# Altium project UWBNode.PrjPCB
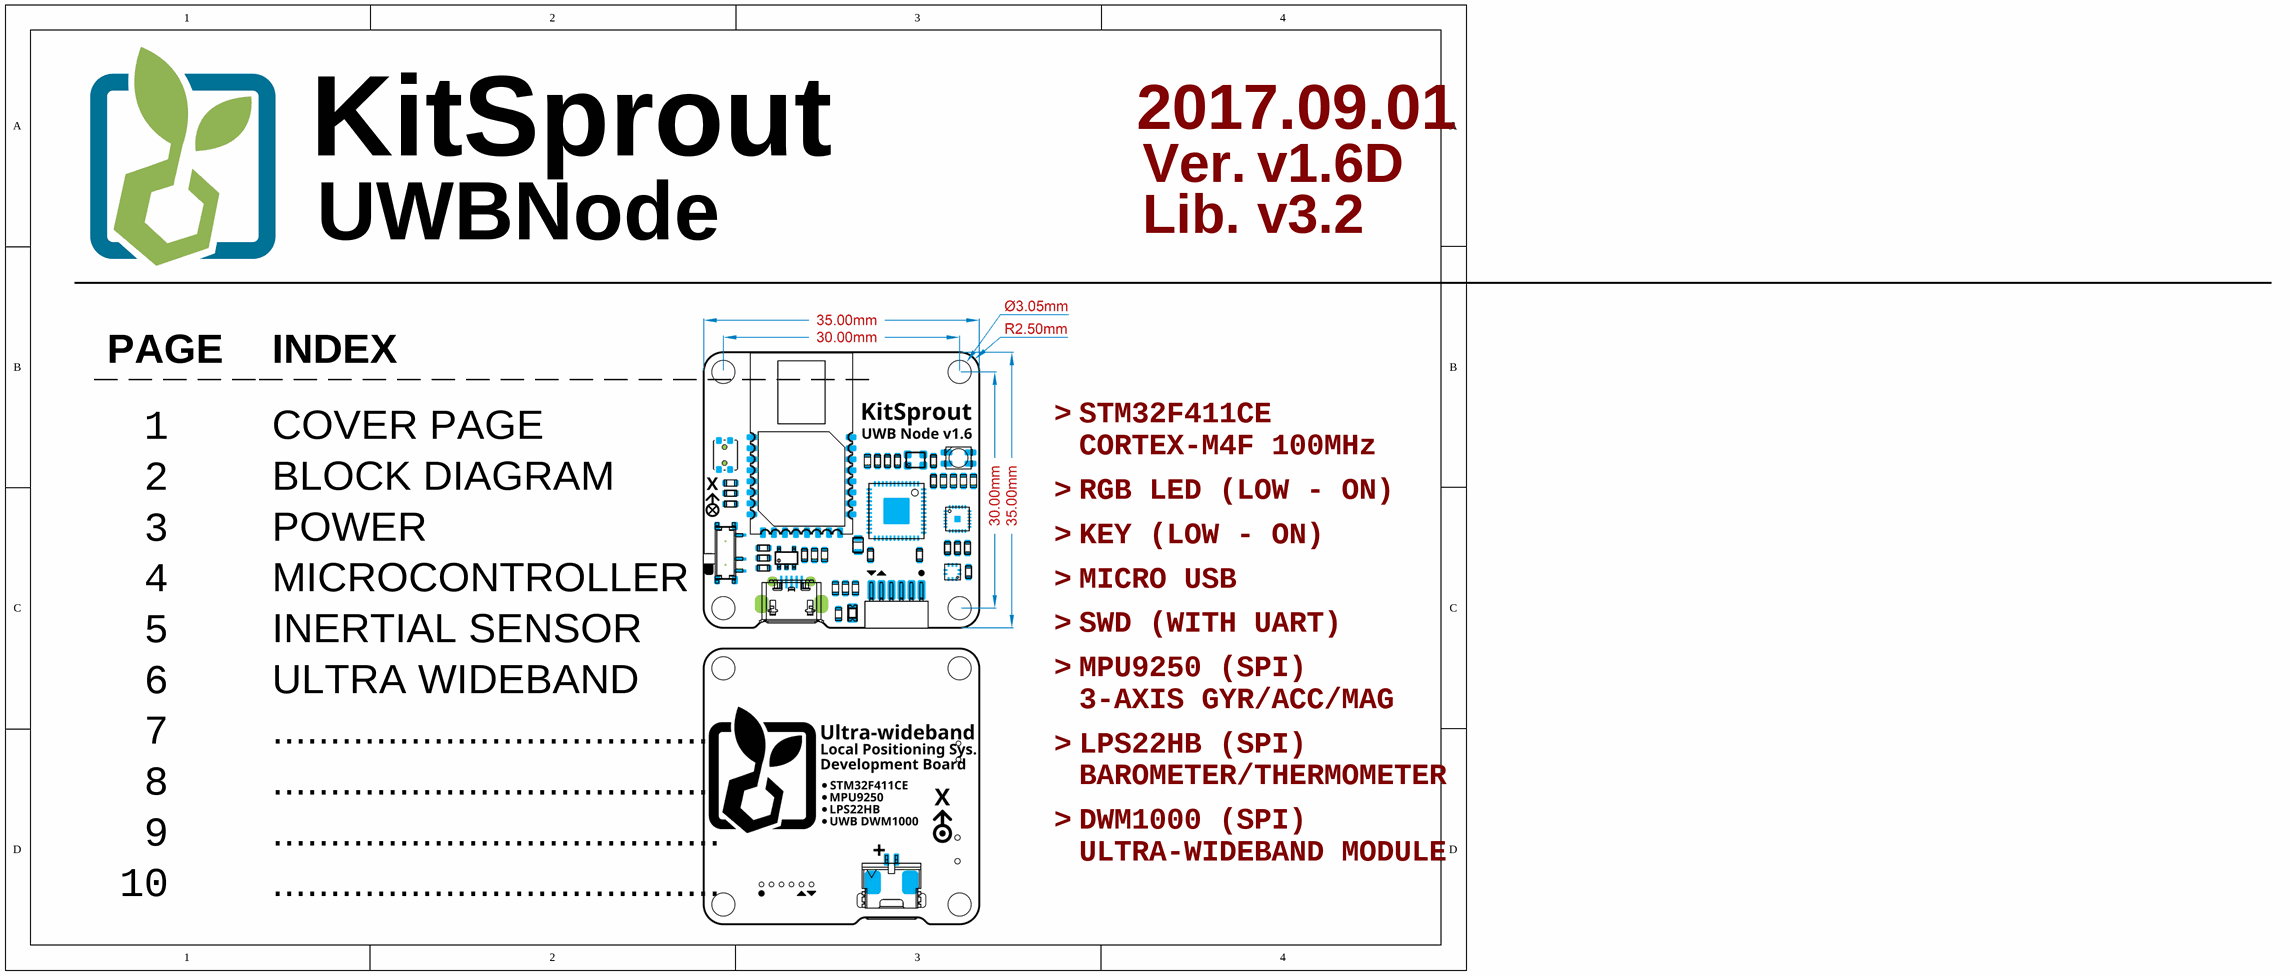
[diagram p0: [01] COVER PAGE.SchDoc]
6 sheets, 43 parts. Net scope: flat (ports and power ports of the same name join across sheets).
Board file: UWBNode.PcbDoc
Sheets:
  [01] COVER PAGE.SchDoc
  [02] BLOCK DIAGRAM.SchDoc
    LDO = [03] POWER.SchDoc
    INERTIAL SENSOR = [05] INERTIAL SENSOR.SchDoc
    STM32 = [04] MICROCONTROLLER.SchDoc
    DWM1000 = [06] ULTRA WIDEBAND.SchDoc

## Sheet [01] COVER PAGE.SchDoc: UWBNode
size A4; Author: Hom; CompanyName: KitSprout; DrawnBy: Hom; Engineer: Hom; Organization: KitSprout; Revision: B; SheetNumber: 1; SheetTotal: 6; Version: v1.6D; LibVersion: v3.2

### Notes on the sheet
- 2017.09.01
- Ver.
- ________________________________________________________________________
- Lib.
- _ _ _ _ _
- PAGE
- _ _ _ _ _ _ _ _ _ _ _ _ _ _ _ _ _ _
- INDEX
- 1
- COVER PAGE
- >
- STM32F411CE
- CORTEX-M4F 100MHz
- 2
- 3
- BLOCK DIAGRAM
- POWER
- RGB LED (LOW - ON)
- KEY (LOW - ON)
- 4
- MICROCONTROLLER
- MICRO USB
- 5
- INERTIAL SENSOR
- SWD (WITH UART)
- 6
- ULTRA WIDEBAND
- MPU9250 (SPI)
- 3-AXIS GYR/ACC/MAG
- 7
- 8
- .......................................
- LPS22HB (SPI)
- BAROMETER/THERMOMETER
- 9
- DWM1000 (SPI)
- ULTRA-WIDEBAND MODULE
- 10

## Sheet [02] BLOCK DIAGRAM.SchDoc: Template
size A4; Author: Hom; CompanyName: KitSprout; DrawnBy: Hom; Engineer: Hom; Organization: KitSprout; Revision: A; SheetNumber: 2; SheetTotal: 6; Version: 0.0; LibVersion: 0.0
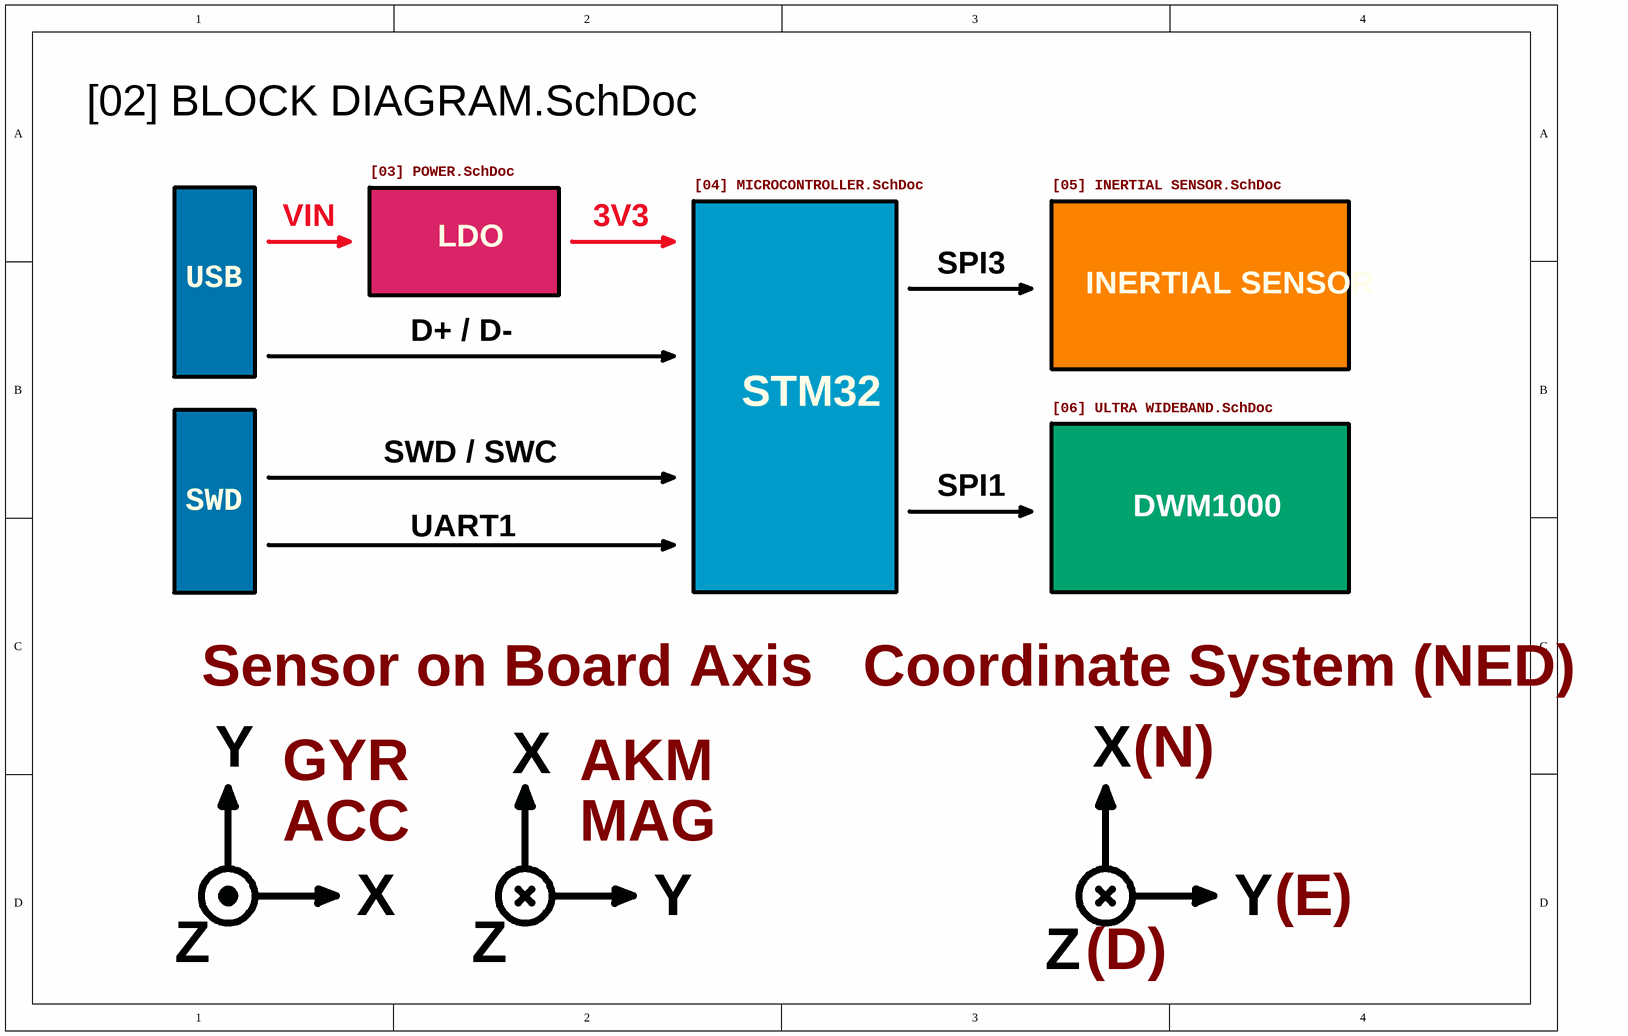
[diagram p1: [02] BLOCK DIAGRAM.SchDoc]

### Sub-sheets
DWM1000 = [06] ULTRA WIDEBAND.SchDoc: no entries
INERTIAL SENSOR = [05] INERTIAL SENSOR.SchDoc: no entries
LDO = [03] POWER.SchDoc: no entries
STM32 = [04] MICROCONTROLLER.SchDoc: no entries

### Notes on the sheet
- VIN
- 3V3
- SPI3
- USB
- D+ / D-
- SWD / SWC
- SPI1
- UART1
- SWD
- Sensor on Board Axis
- Coordinate System (NED)
- Y
- GYR
- X
- AKM
- (N)
- ACC
- MAG
- (E)
- Z
- (D)

## Sheet [03] POWER.SchDoc: Template
size A4; Author: Hom; CompanyName: KitSprout; DrawnBy: Hom; Engineer: Hom; Organization: KitSprout; Revision: A; SheetNumber: 3; SheetTotal: 6; Version: 0.0; LibVersion: 0.0
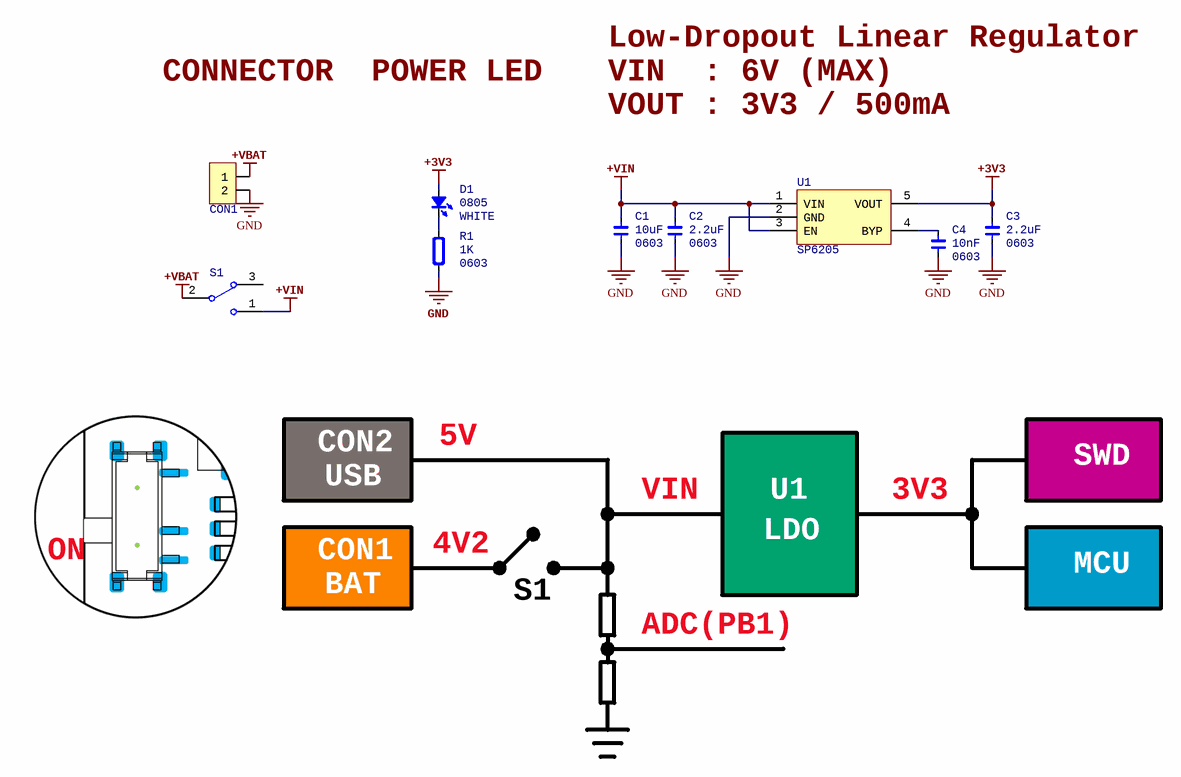
[diagram p2: [03] POWER.SchDoc]

### Parts
C1  Type: 0603  [CAP_0603]  (hidden comment: 10uF)
C2  Type: 0603  [CAP_0603]  (hidden comment: 2.2uF)
C3  Type: 0603  [CAP_0603]  (hidden comment: 2.2uF)
C4  Type: 0603  [CAP_0603]  (hidden comment: 10nF)
CON1  MX1.25_2P  [MX1.25_S90_2P]  (value not drawn)
D1  Type: 0805  [LED_0805_YELLOW]  (hidden comment: WHITE)
R1  Type: 0603  [RES_0603]  (hidden comment: 1K)
S1  SPDT 3P  [SwitchSPDT_2.8X6.6_90]  (value not drawn)
U1  SP6205  [SOT23-5]

### Nets
+3V3: C3.2 D1.1(A) U1.5(VOUT)
+VBAT: CON1.1 S1.2
+VIN: C1.2 C2.2 S1.1 U1.1(VIN) U1.3(EN)
GND: C1.1 C2.1 C3.1 C4.1 CON1.2 R1.1 U1.2(GND)
NetC4_2: C4.2 U1.4(BYP)
NetD1_2: D1.2(K) R1.2

Not connected (* = marked no-connect by the designer): S1 3

### Notes on the sheet
- CONNECTOR
- POWER LED
- Low-Dropout Linear Regulator
- VIN  : 6V (MAX)
- VOUT : 3V3 / 500mA
- CON2
- USB
- 5V
- SWD
- VIN
- LDO
- U1
- 3V3
- ON
- CON1
- BAT
- 4V2
- S1
- MCU
- ADC(PB1)

### Library data of the parts
C1-C4 = Cap_0603: Capacitor
  C1: Value: 10uF
  C2 C3: Value: 2.2uF
  C4: Value: 10nF
CON1 = MX1.25_2P: MX
D1 = LED_0805: LED; Value: WHITE
R1 = Res_0603: Resistor; Value: 1K
S1 = SwitchSPDT_2.8x6.6_90: Switch; Value: SPDT 3P; Type: SPDT
U1 = SP6205: Power; Type: SOT23-5

## Sheet [05] INERTIAL SENSOR.SchDoc: Template
size A4; Author: Hom; CompanyName: KitSprout; DrawnBy: Hom; Engineer: Hom; Organization: KitSprout; Revision: A; SheetNumber: 5; SheetTotal: 6; Version: 0.0; LibVersion: 0.0
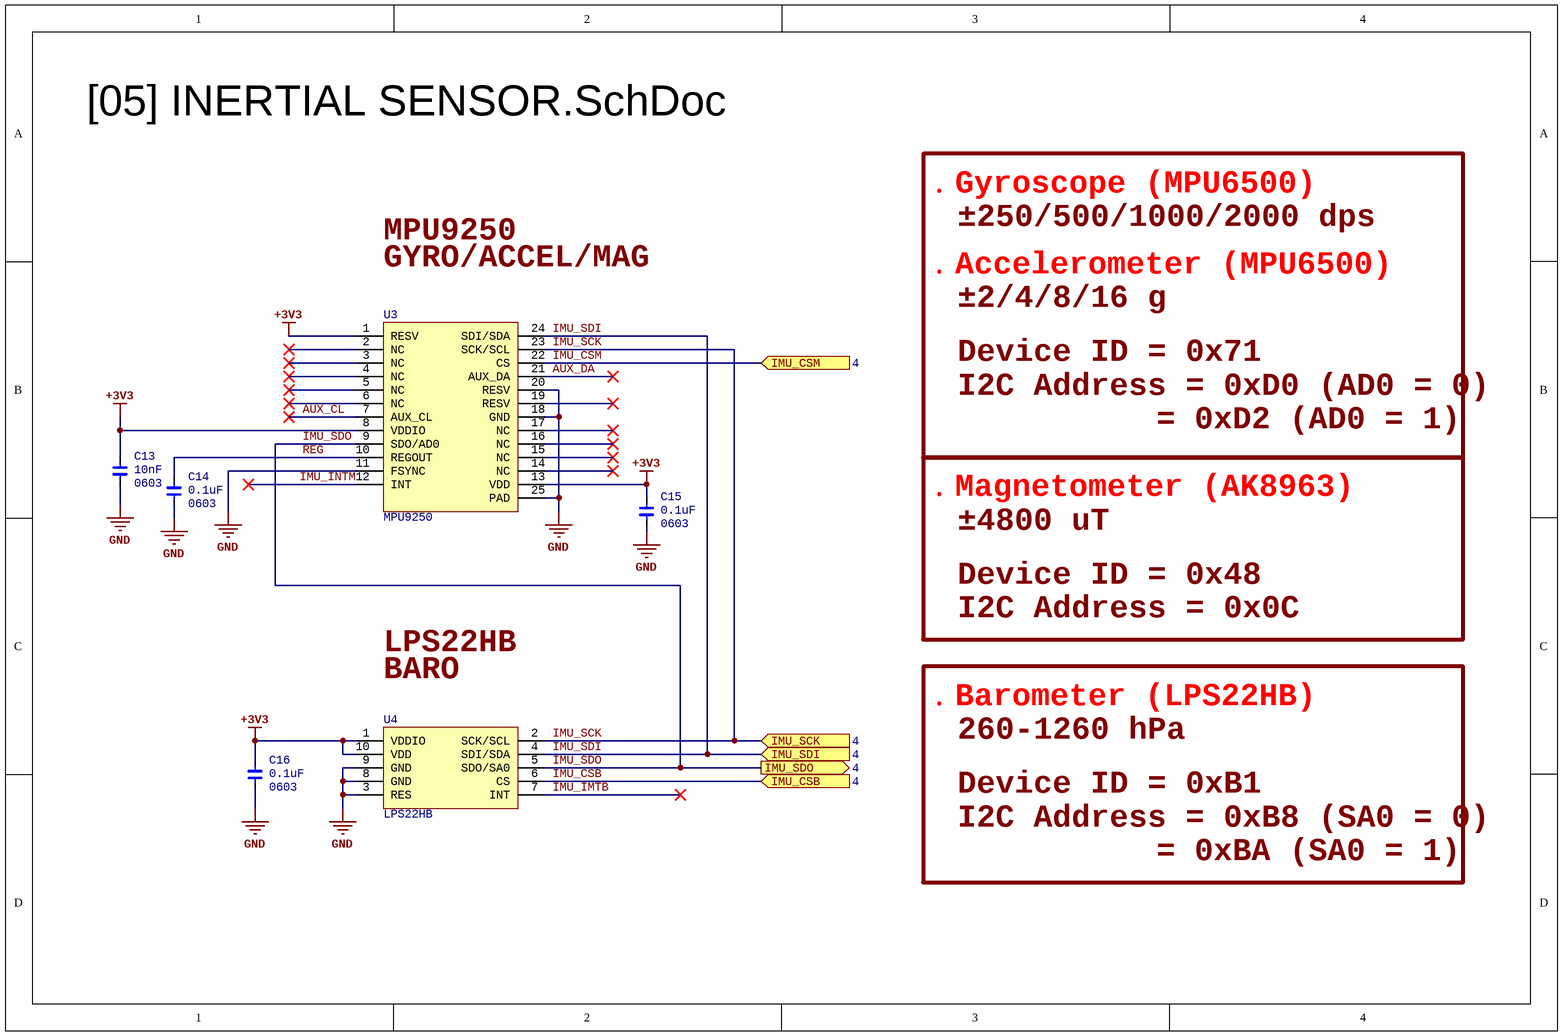
[diagram p3: [05] INERTIAL SENSOR.SchDoc]

### Parts
C13  Type: 0603  [CAP_0603]  (hidden comment: 10nF)
C14  Type: 0603  [CAP_0603]  (hidden comment: 0.1uF)
C15  Type: 0603  [CAP_0603]  (hidden comment: 0.1uF)
C16  Type: 0603  [CAP_0603]  (hidden comment: 0.1uF)
U3  MPU9250  [QFN_P0.4_24]
U4  LPS22HB  [HCLGA-2x2_10]

### Ports
IMU_CSB (in, see 4), IMU_CSM (in, see 4), IMU_SCK (in, see 4), IMU_SDI (in, see 4), IMU_SDO (out, see 4)

### Nets
+3V3: C13.2 C15.2 C16.2 U3.1(RESV) U3.8(VDDIO) U3.13(VDD) U4.1(VDDIO) U4.10(VDD)
GND: C13.1 C14.1 C15.1 C16.1 U3.11(FSYNC) U3.18(GND) U3.20(RESV) U3.25(PAD) U4.3(RES) U4.8(GND) U4.9(GND)
AUX_CL: U3.7(AUX_CL)
AUX_DA: U3.21(AUX_DA)
IMU_CSB: U4.6(CS) ; port IMU_CSB
IMU_CSM: U3.22(CS) ; port IMU_CSM
IMU_IMTB: U4.7(INT)
IMU_INTM: U3.12(INT)
IMU_SCK: U3.23(SCK/SCL) U4.2(SCK/SCL) ; port IMU_SCK
IMU_SDI: U3.24(SDI/SDA) U4.4(SDI/SDA) ; port IMU_SDI
IMU_SDO: U3.9(SDO/AD0) U4.5(SDO/SA0) ; port IMU_SDO
REG: C14.2 U3.10(REGOUT)

Not connected (* = marked no-connect by the designer): U3 2(NC)* 3(NC)* 4(NC)* 5(NC)* 6(NC)* 14(NC)* 15(NC)* 16(NC)* 17(NC)* 19(RESV)*

### Notes on the sheet
- MPU9250
- ．Gyroscope (MPU6500)
- ±250/500/1000/2000 dps
- GYRO/ACCEL/MAG
- ．Accelerometer (MPU6500)
- ±2/4/8/16 g
- Device ID = 0x71
- I2C Address = 0xD0 (AD0 = 0)
- = 0xD2 (AD0 = 1)
- ．Magnetometer (AK8963)
- ±4800 uT
- LPS22HB
- I2C Address = 0x0C
- Device ID = 0x48
- BARO
- ．Barometer (LPS22HB)
- 260-1260 hPa
- Device ID = 0xB1
- I2C Address = 0xB8 (SA0 = 0)
- = 0xBA (SA0 = 1)

### Library data of the parts
C13-C16 = Cap_0603: Capacitor
  C13: Value: 10nF
  C14-C16: Value: 0.1uF
U3 = MPU925x: Sensor Motion; Type: QFN24 P0.4
U4 = LPS22HB: Sensor Pressure; Type: LGA10 P0.5

## Sheet [04] MICROCONTROLLER.SchDoc: Template
size A4; Author: Hom; CompanyName: KitSprout; DrawnBy: Hom; Engineer: Hom; Organization: KitSprout; Revision: A; SheetNumber: 4; SheetTotal: 6; Version: 0.0; LibVersion: 0.0
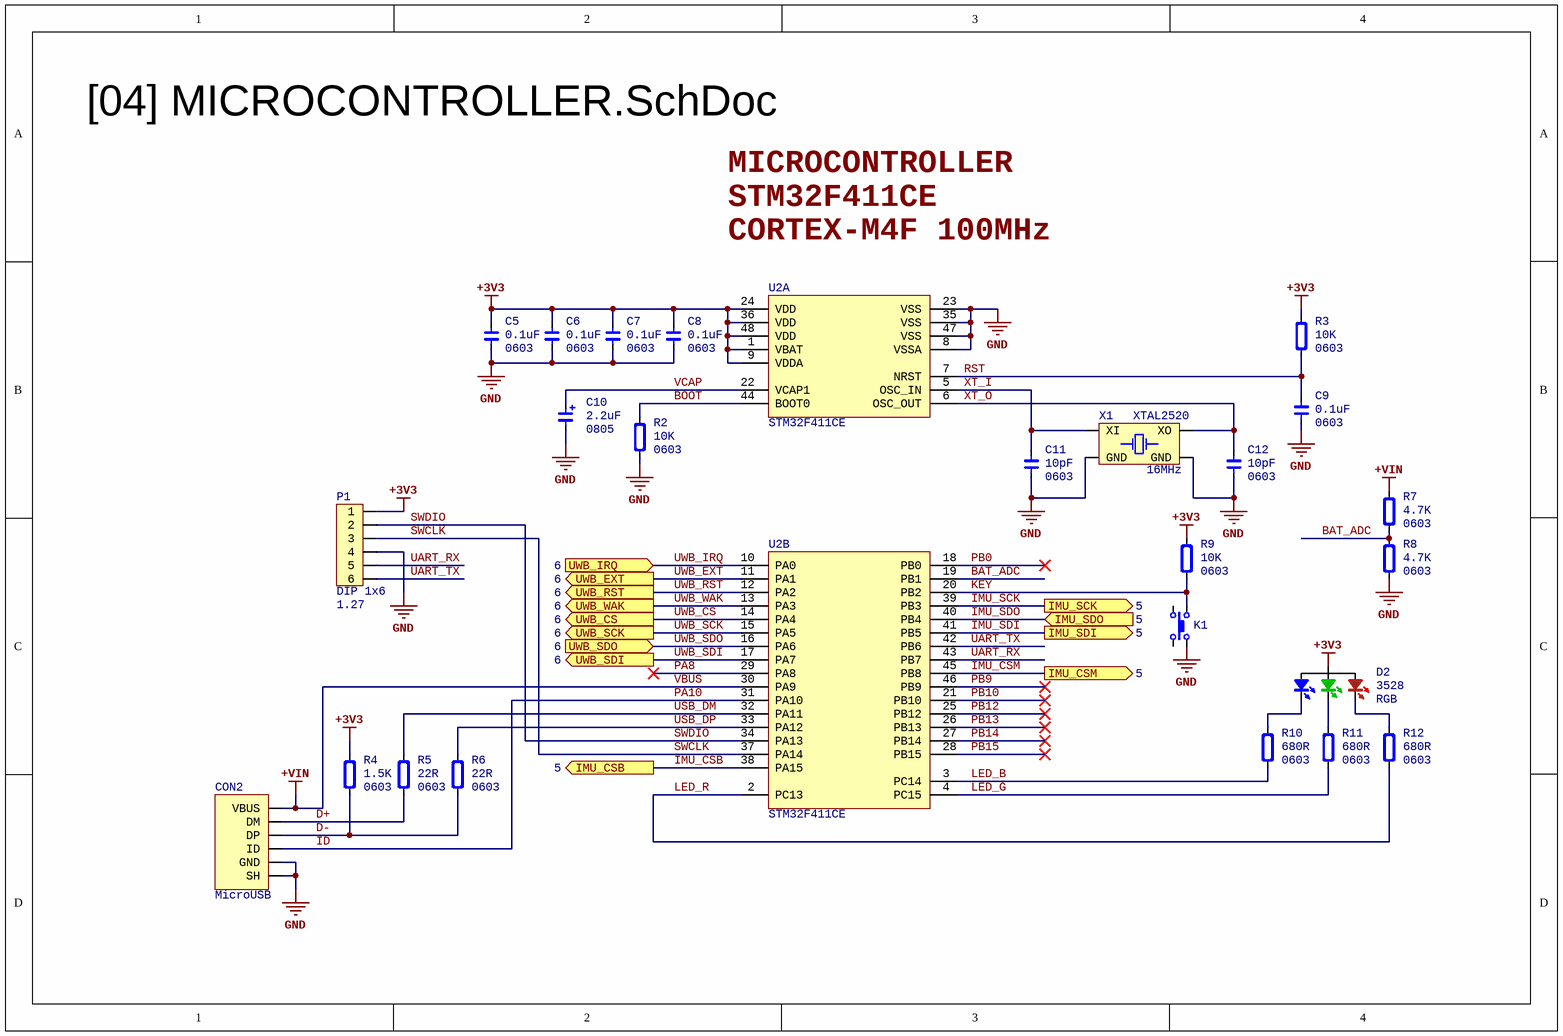
[diagram p4: [04] MICROCONTROLLER.SchDoc]

### Parts
C5  Type: 0603  [CAP_0603]  (hidden comment: 0.1uF)
C6  Type: 0603  [CAP_0603]  (hidden comment: 0.1uF)
C7  Type: 0603  [CAP_0603]  (hidden comment: 0.1uF)
C8  Type: 0603  [CAP_0603]  (hidden comment: 0.1uF)
C9  Type: 0603  [CAP_0603]  (hidden comment: 0.1uF)
C10  Type: 0805  [CAP_TAN_P0805]  (hidden comment: 2.2uF)
C11  Type: 0603  [CAP_0603]  (hidden comment: 10pF)
C12  Type: 0603  [CAP_0603]  (hidden comment: 10pF)
CON2  MicroUSB  [USB_Micro-AB]
D2  Type: 3528  [LED_3528_RGB]  (hidden comment: RGB)
K1  ButtonTACT  [ButtonTACT_3.4*3.5_90]  (value not drawn)
P1  value 1.27  [HDR1X6_1.27_180HF]  (hidden comment: DIP 1x6)
R2  Type: 0603  [RES_0603]  (hidden comment: 10K)
R3  Type: 0603  [RES_0603]  (hidden comment: 10K)
R4  Type: 0603  [RES_0603]  (hidden comment: 1.5K)
R5  Type: 0603  [RES_0603]  (hidden comment: 22R)
R6  Type: 0603  [RES_0603]  (hidden comment: 22R)
R7  Type: 0603  [RES_0603]  (hidden comment: 4.7K)
R8  Type: 0603  [RES_0603]  (hidden comment: 4.7K)
R9  Type: 0603  [RES_0603]  (hidden comment: 10K)
R10  Type: 0603  [RES_0603]  (hidden comment: 680R)
R11  Type: 0603  [RES_0603]  (hidden comment: 680R)
R12  Type: 0603  [RES_0603]  (hidden comment: 680R)
U2  STM32F411CE  [QFN_P0.5_48]  (parts A,B of 2)
X1  Type: XTAL2520  [XT_2520_4]  (hidden comment: 16MHz)

### Ports
IMU_CSB (out, see 5), IMU_CSM (out, see 5), IMU_SCK (out, see 5), IMU_SDI (out, see 5), IMU_SDO (in, see 5), UWB_CS (out, see 6), UWB_EXT (out, see 6), UWB_IRQ (in, see 6), UWB_RST (out, see 6), UWB_SCK (out, see 6), UWB_SDI (out, see 6), UWB_SDO (in, see 6), UWB_WAK (out, see 6)

### Nets
+3V3: C5.2 C6.2 C7.2 C8.2 D2.4(A) P1.1 R3.2 R4.2 R9.2 U2.1(VBAT) U2.9(VDDA) U2.24(VDD) U2.36(VDD) U2.48(VDD)
+VIN: CON2.1(VBUS) R7.2 U2.30(PA9)
GND: C5.1 C6.1 C7.1 C8.1 C9.1 C10.2 C11.1 C12.1 CON2.0(SH) CON2.5(GND) K1.2 P1.4 R2.1 R8.1 U2.8(VSSA) U2.23(VSS) U2.35(VSS) U2.47(VSS) X1.2(GND) X1.4(GND)
BAT_ADC: R7.1 R8.2 U2.19(PB1)
BOOT: R2.2 U2.44(BOOT0)
D+: CON2.2(DM) R5.1
D-: CON2.3(DP) R4.1 R6.1
ID: CON2.4(ID) U2.31(PA10)  [also labelled PA10]
IMU_CSB: U2.38(PA15) ; port IMU_CSB
IMU_CSM: U2.45(PB8) ; port IMU_CSM
IMU_SCK: U2.39(PB3) ; port IMU_SCK
IMU_SDI: U2.41(PB5) ; port IMU_SDI
IMU_SDO: U2.40(PB4) ; port IMU_SDO
KEY: K1.1 R9.1 U2.20(PB2)
LED_B: R10.1 U2.3(PC14)
LED_G: R11.1 U2.4(PC15)
LED_R: R12.1 U2.2(PC13)
PA8: U2.29(PA8)
PB0: U2.18(PB0)
PB9: U2.46(PB9)
PB10: U2.21(PB10)
PB12: U2.25(PB12)
PB13: U2.26(PB13)
PB14: U2.27(PB14)
PB15: U2.28(PB15)
RST: C9.2 R3.1 U2.7(NRST)
SWCLK: P1.3 U2.37(PA14)
SWDIO: P1.2 U2.34(PA13)
UART_RX: P1.5 U2.43(PB7)
UART_TX: P1.6 U2.42(PB6)
USB_DM: R5.2 U2.32(PA11)
USB_DP: R6.2 U2.33(PA12)
UWB_CS: U2.14(PA4) ; port UWB_CS
UWB_EXT: U2.11(PA1) ; port UWB_EXT
UWB_IRQ: U2.10(PA0) ; port UWB_IRQ
UWB_RST: U2.12(PA2) ; port UWB_RST
UWB_SCK: U2.15(PA5) ; port UWB_SCK
UWB_SDI: U2.17(PA7) ; port UWB_SDI
UWB_SDO: U2.16(PA6) ; port UWB_SDO
UWB_WAK: U2.13(PA3) ; port UWB_WAK
VCAP: C10.1 U2.22(VCAP1)
XT_I: C11.2 U2.5(OSC_IN) X1.1(XI)
XT_O: C12.2 U2.6(OSC_OUT) X1.3(XO)
NetD2_1: D2.1(R) R12.2
NetD2_2: D2.2(G) R11.2
NetD2_3: D2.3(B) R10.2

Not connected (* = marked no-connect by the designer): K1 3 4

### Notes on the sheet
- MICROCONTROLLER
- STM32F411CE
- CORTEX-M4F 100MHz
- VBUS

### Library data of the parts
C5-C9 C11 C12 = Cap_0603: Capacitor
  C5-C9: Value: 0.1uF
  C11 C12: Value: 10pF
C10 = Cap_Tan_0805: Capacitor Tantalum; Value: 2.2uF
CON2 = USB_Micro: USB
D2 = LED_3528_RGB: LED; Value: RGB
K1 = ButtonTACT: Button; Value: ButtonTACT
P1 = HDR1x6_1.27T: Header; Type: DIP 1x6
R2-R12 = Res_0603: Resistor
  R2 R3 R9: Value: 10K
  R4: Value: 1.5K
  R5 R6: Value: 22R
  R7 R8: Value: 4.7K
  R10-R12: Value: 680R
U2 = STM32F4x1C: MCU; Type: QFN48 P0.5
X1 = XTAL_2520_4P: Crystal Oscillator; Value: 16MHz

## Sheet [06] ULTRA WIDEBAND.SchDoc: Template
size A4; Author: Hom; CompanyName: KitSprout; DrawnBy: Hom; Engineer: Hom; Organization: KitSprout; Revision: A; SheetNumber: 6; SheetTotal: 6; Version: 0.0; LibVersion: 0.0
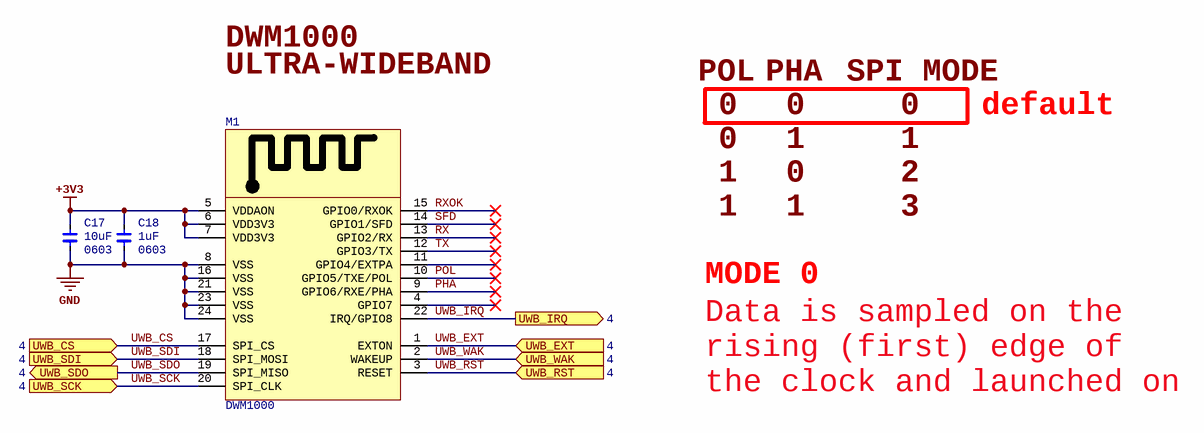
[diagram p5: [06] ULTRA WIDEBAND.SchDoc]

### Parts
C17  Type: 0603  [CAP_0603]  (hidden comment: 10uF)
C18  Type: 0603  [CAP_0603]  (hidden comment: 1uF)
M1  DWM1000  [DWM1000]

### Ports
UWB_CS (in, see 4), UWB_EXT (in, see 4), UWB_IRQ (out, see 4), UWB_RST (in, see 4), UWB_SCK (in, see 4), UWB_SDI (in, see 4), UWB_SDO (out, see 4), UWB_WAK (in, see 4)

### Nets
+3V3: C17.2 C18.2 M1.5(VDDAON) M1.6(VDD3V3) M1.7(VDD3V3)
GND: C17.1 C18.1 M1.8(VSS) M1.16(VSS) M1.21(VSS) M1.23(VSS) M1.24(VSS)
PHA: M1.9(GPIO6/RXE/PHA)
POL: M1.10(GPIO5/TXE/POL)
RX: M1.13(GPIO2/RX)
RXOK: M1.15(GPIO0/RXOK)
SFD: M1.14(GPIO1/SFD)
TX: M1.12(GPIO3/TX)
UWB_CS: M1.17(SPI_CS) ; port UWB_CS
UWB_EXT: M1.1(EXTON) ; port UWB_EXT
UWB_IRQ: M1.22(IRQ/GPIO8) ; port UWB_IRQ
UWB_RST: M1.3(RESET) ; port UWB_RST
UWB_SCK: M1.20(SPI_CLK) ; port UWB_SCK
UWB_SDI: M1.18(SPI_MOSI) ; port UWB_SDI
UWB_SDO: M1.19(SPI_MISO) ; port UWB_SDO
UWB_WAK: M1.2(WAKEUP) ; port UWB_WAK

Not connected (* = marked no-connect by the designer): M1 4(GPIO7)* 11(GPIO4/EXTPA)*

### Notes on the sheet
- ULTRA-WIDEBAND
- DWM1000
- POL
- PHA
- SPI MODE
- 0
- 1
- default
- 2
- 3
- MODE 0
- Data is sampled on the rising (first) edge of the clock and launched on the falling (second) edge.

### Library data of the parts
C17 C18 = Cap_0603: Capacitor
  C17: Value: 10uF
  C18: Value: 1uF
M1 = DWM1000: Module; Manufacturer: Decawave Limited; Frequency: 3.5GHz ~ 6.5GHz; Data Rate: 6.8Mbps; Serial Interfaces: SPI; Antenna Type: Integrated, Chip; Voltage - Supply: 2.8 V ~ 3.6 V; Current - Receiving: 64mA; Current - Transmitting: 31mA; Supplier 1: Digi-Key; Manufacturer Part Number: DWM1000; RoHS: RoHS Compliant; Category: RF/IF and RFID; Stock 1: 1028; Pricing 1: 1=32.16, 10=26.704, 100=24.24, 250=22.51296 (USD); Packaging: Cut Tape (CT); RF Family/Standard: 802.15.4; Protocol: -; Modulation: -; Power - Output: -; Sensitivity: -; Memory Size: -; Mounting Type: Surface Mount; Operating Temperature: -40°C ~ 85°C; Package / Case: Module; ComponentLink1URL: http://www.decawave.com/sites/default/files/product-pdf/dwm1000-product-brief.pdf; ComponentLink1Description: http://www.decawave.com/sites/default/files/product-pdf/dwm1000-product-brief.pdf; Supplier Part Number 1: 1479-1002-1-ND

## Nets that join several sheets
+3V3: [03] POWER (C3.2 D1.1 U1.5), [05] INERTIAL SENSOR (8 pins), [04] MICROCONTROLLER (14 pins), [06] ULTRA WIDEBAND (5 pins)
+VIN: [03] POWER (5 pins), [04] MICROCONTROLLER (CON2.1 R7.2 U2.30)
GND: [03] POWER (7 pins), [05] INERTIAL SENSOR (11 pins), [04] MICROCONTROLLER (20 pins), [06] ULTRA WIDEBAND (7 pins)
IMU_CSB: [05] INERTIAL SENSOR (U4.6), [04] MICROCONTROLLER (U2.38)
IMU_CSM: [05] INERTIAL SENSOR (U3.22), [04] MICROCONTROLLER (U2.45)
IMU_SCK: [05] INERTIAL SENSOR (U3.23 U4.2), [04] MICROCONTROLLER (U2.39)
IMU_SDI: [05] INERTIAL SENSOR (U3.24 U4.4), [04] MICROCONTROLLER (U2.41)
IMU_SDO: [05] INERTIAL SENSOR (U3.9 U4.5), [04] MICROCONTROLLER (U2.40)
UWB_CS: [04] MICROCONTROLLER (U2.14), [06] ULTRA WIDEBAND (M1.17)
UWB_EXT: [04] MICROCONTROLLER (U2.11), [06] ULTRA WIDEBAND (M1.1)
UWB_IRQ: [04] MICROCONTROLLER (U2.10), [06] ULTRA WIDEBAND (M1.22)
UWB_RST: [04] MICROCONTROLLER (U2.12), [06] ULTRA WIDEBAND (M1.3)
UWB_SCK: [04] MICROCONTROLLER (U2.15), [06] ULTRA WIDEBAND (M1.20)
UWB_SDI: [04] MICROCONTROLLER (U2.17), [06] ULTRA WIDEBAND (M1.18)
UWB_SDO: [04] MICROCONTROLLER (U2.16), [06] ULTRA WIDEBAND (M1.19)
UWB_WAK: [04] MICROCONTROLLER (U2.13), [06] ULTRA WIDEBAND (M1.2)